# Altium project BKRES_IOT_BOARD.PrjPcb
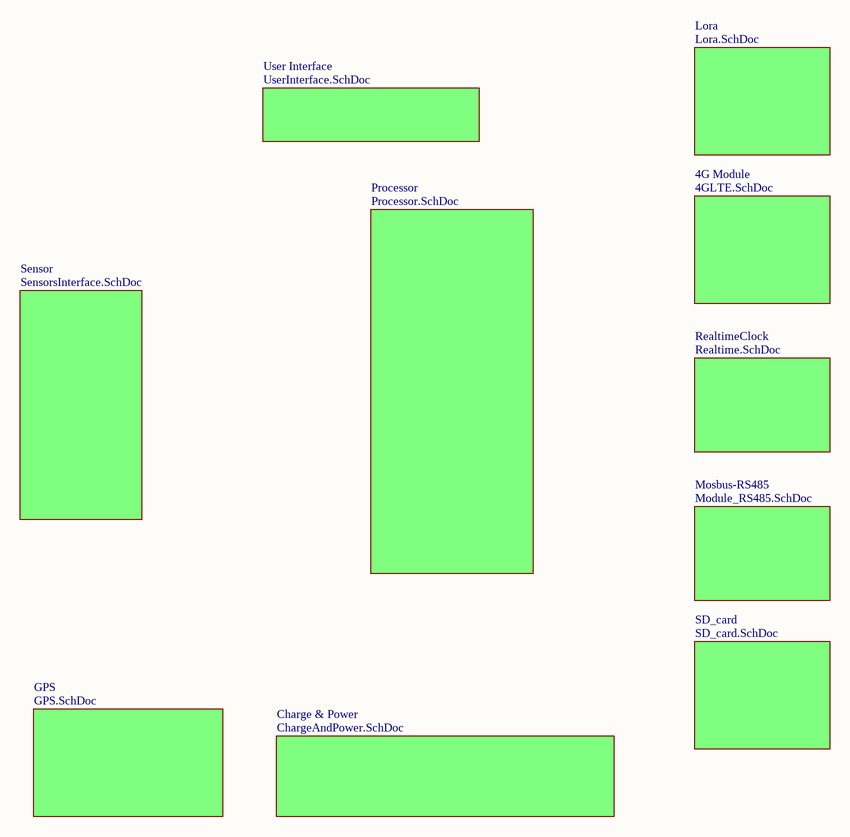
[diagram p0: BKRES_IOT_BOARD.SchDoc]
10 sheets, 25 parts. Net scope: global (net labels, ports and power ports of the same name join across sheets).
Board file: BKRES_IOT_BOARD.PcbDoc
Sheets:
  BKRES_IOT_BOARD.SchDoc
    Sensor = SensorsInterface.SchDoc
    Processor = Processor.SchDoc
    Lora = Lora.SchDoc
    4G Module = 4GLTE.SchDoc
    RealtimeClock = Realtime.SchDoc
    Charge & Power = ChargeAndPower.SchDoc
    Mosbus-RS485 = Module_RS485.SchDoc
    SD_card = SD_card.SchDoc
    GPS = GPS.SchDoc

## Sheet BKRES_IOT_BOARD.SchDoc
size A; SheetNumber: 1; SheetTotal: 11

### Sub-sheets
4G Module = 4GLTE.SchDoc: no entries
Charge & Power = ChargeAndPower.SchDoc: no entries
GPS = GPS.SchDoc: no entries
Lora = Lora.SchDoc: no entries
Mosbus-RS485 = Module_RS485.SchDoc: no entries
Processor = Processor.SchDoc: no entries
RealtimeClock = Realtime.SchDoc: no entries
SD_card = SD_card.SchDoc: no entries
Sensor = SensorsInterface.SchDoc: no entries
User Interface = UserInterface.SchDoc (file not in this document): no entries

## Sheet SensorsInterface.SchDoc
size A; SheetNumber: 2; SheetTotal: 10

## Sheet Processor.SchDoc
size A; SheetNumber: 3; SheetTotal: 11
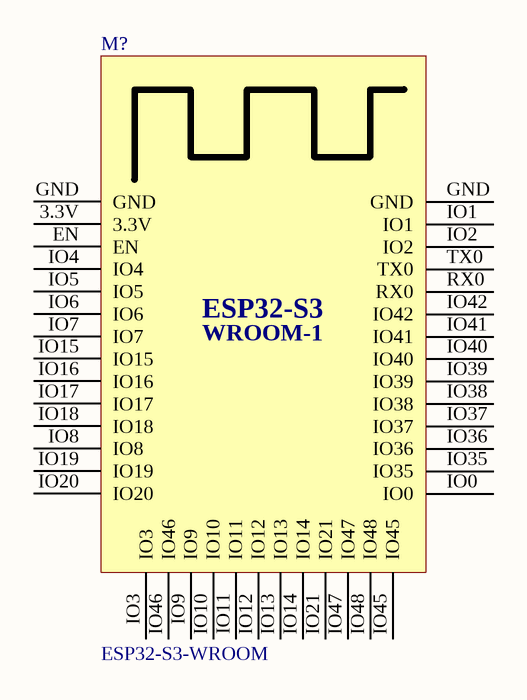
[diagram p1: Processor.SchDoc]

### Parts
M?  ESP32-S3-WROOM  [ESP32-S3-WROOM-1]

### Nets

Not connected (* = marked no-connect by the designer): M? 3.3V EN GND IO0 IO1 IO2 IO3 IO4 IO5 IO6 IO7 IO8 IO9 IO10 IO11 IO12 IO13 IO14 IO15 IO16 IO17 IO18 IO19 IO20 IO21 IO35 IO36 IO37 IO38 IO39 IO40 IO41 IO42 IO45 IO46 IO47 IO48 RX0 TX0

### Notes on the sheet
- (in symbol ESP32-S3-WROOM-1) ESP32-S3; WROOM-1

### Library data of the parts
M? = ESP32-S3-WROOM-1: Datasheet: https://www.espressif.com/sites/default/files/documentation/esp32-s3-wroom-1_wroom-1u_datasheet_en.pdf

## Sheet Lora.SchDoc
size A; SheetNumber: 4; SheetTotal: 11
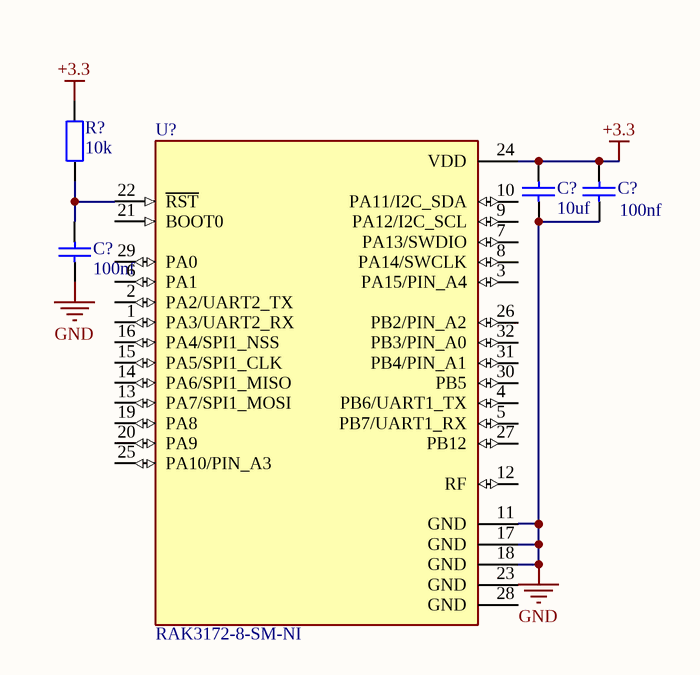
[diagram p2: Lora.SchDoc]

### Parts
(Parts that share a designator on the sheet are numbered #1, #2 ... from top to bottom, then left to right.)
C?#1  10uf  [tu 0805]
C?#2  100nf  [tu 0805]
C?#3  100nf  [tu 0805]
R?#1  10k  [tro smd 0805]
U?#1  RAK3172-8-SM-NI  [XCVR_RAK3172-8-SM-NI]

### Nets
+3.3: C?#1.1 C?#2.1 R?#1.2 U?#1.24(VDD)
GND: C?#1.2 C?#2.2 C?#3.2 U?#1.11(GND) U?#1.17(GND) U?#1.18(GND)
NetC?#3_1: C?#3.1 R?#1.1 U?#1.22(~{RST})

Not connected (* = marked no-connect by the designer): U?#1 1(PA3/UART2_RX) 2(PA2/UART2_TX) 3(PA15/PIN_A4) 4(PB6/UART1_TX) 5(PB7/UART1_RX) 6(PA1) 7(PA13/SWDIO) 8(PA14/SWCLK) 9(PA12/I2C_SCL) 10(PA11/I2C_SDA) 12(RF) 13(PA7/SPI1_MOSI) 14(PA6/SPI1_MISO) 15(PA5/SPI1_CLK) 16(PA4/SPI1_NSS) 19(PA8) 20(PA9) 21(BOOT0) 23(GND) 25(PA10/PIN_A3) 26(PB2/PIN_A2) 27(PB12) 28(GND) 29(PA0) 30(PB5) 31(PB4/PIN_A1) 32(PB3/PIN_A0)

### Library data of the parts
C?#1-C?#3 = Tu 0805 104 50V 10%: Dán; Don_Vi: Con; So_Chan: 2; Ten_Linh_Kien: Tụ 0805 104-100nF 10% 50V; Ma_Hang: MH004551; Chung_Loai: Dán; Kieu_Chan: *
R?#1 = Tro 0805 1% 10R: Dán; Don_Vi: Con; So_Chan: 2; Ten_Linh_Kien: Trở 0805 1% 10R; Ma_Hang: MH005474; Chung_Loai: Dán; Kieu_Chan: *
U?#1 = RAK3172-8-SM-NI: RF IC Transceiver LoRaWAN 864MHz, 865MHz, 868MHz 2V ~ 3.6V Supply, Without IPEX Connector; MF: RAKwireless Technology Limited; Package: None; Price: None; Check_prices: https://www.snapeda.com/parts/RAK3172-8-SM-NI/ESS+Technology/view-part/?ref=eda; Value: *; SnapEDA_Link: https://www.snapeda.com/parts/RAK3172-8-SM-NI/ESS+Technology/view-part/?ref=snap; MP: RAK3172-8-SM-NI; Availability: In Stock; Purchase-URL: https://pricing.snapeda.com/search?q=RAK3172-8-SM-NI&ref=eda

## Sheet 4GLTE.SchDoc
size A; SheetNumber: 5; SheetTotal: 11
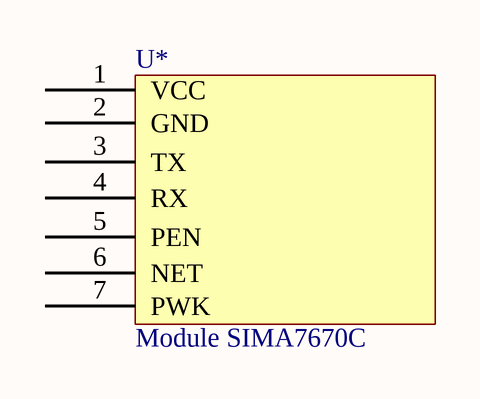
[diagram p3: 4GLTE.SchDoc]

### Parts
(Parts that share a designator on the sheet are numbered #1, #2 ... from top to bottom, then left to right.)
U*#1  Module SIMA7670C  [Module sim7670C]

### Nets

Not connected (* = marked no-connect by the designer): U*#1 1(VCC) 2(GND) 3(TX) 4(RX) 5(PEN) 6(NET) 7(PWK)

## Sheet Realtime.SchDoc
size A; SheetNumber: 6; SheetTotal: 11
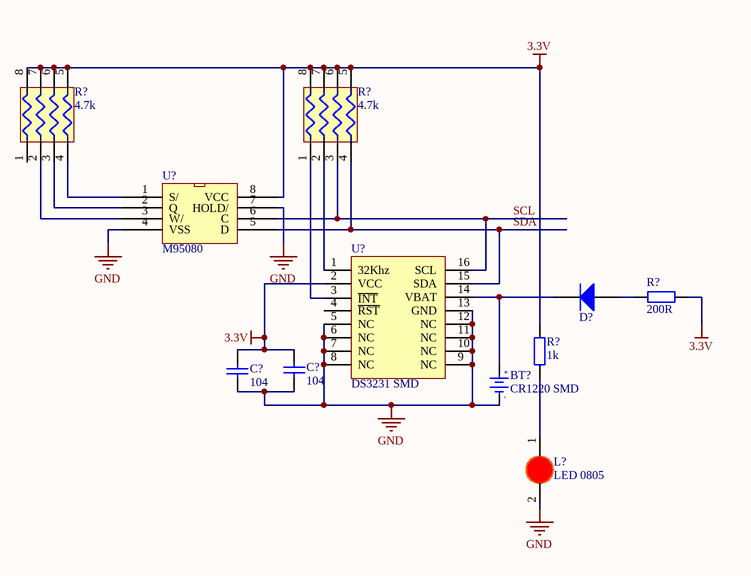
[diagram p4: Realtime.SchDoc]

### Parts
(Parts that share a designator on the sheet are numbered #1, #2 ... from top to bottom, then left to right.)
BT?  CR1220 SMD  [DE PIN CR1220]
C?#4  104  [tu 0805]
C?#5  104  [tu 0805]
D?  Diode  [SOD80]  (value not drawn)
L?  LED 0805  [LED-0805-Red]
R?#2  4.7k  [tro bang 0603 4]
R?#3  4.7k  [tro bang 0603 4]
R?#4  200R  [tro smd 0805]
R?#5  1k  [tro smd 0805]
U?#2  M95080  [SOP8_L]
U?#3  DS3231 SMD  [SOIC 16]

### Nets
3.3V: C?#4.1 C?#5.1 R?#2.5 R?#2.6 R?#2.7 R?#2.8 R?#3.5 R?#3.6 R?#3.7 R?#3.8 R?#4.2 R?#5.2 U?#2.8(VCC) U?#3.2(VCC)
GND: BT?.2(GND) C?#4.2 C?#5.2 L?.2(K) U?#2.4(VSS) U?#2.7(HOLD/) U?#3.5(NC) U?#3.6(NC) U?#3.7(NC) U?#3.8(NC) U?#3.9(NC) U?#3.10(NC) U?#3.11(NC) U?#3.12(NC) U?#3.13(GND)
SCL: R?#3.3 U?#2.6(C) U?#3.16(SCL)
SDA: R?#3.4 U?#2.5(D) U?#3.15(SDA)
NetBT?_1: BT?.1(+3V) D?.2(K) U?#3.14(VBAT)
NetD?_1: D?.1(A) R?#4.1
NetL?_1: L?.1(A) R?#5.1
NetR?#2_2: R?#2.2 U?#2.3(W/)
NetR?#2_3: R?#2.3 U?#2.2(Q)
NetR?#2_4: R?#2.4 U?#2.1(S/)
NetR?#3_1: R?#3.1 U?#3.3(~{INT})
NetR?#3_2: R?#3.2 U?#3.1(32Khz)

Not connected (* = marked no-connect by the designer): R?#2 1; U?#3 4(~{RST})

### Notes on the sheet
- (in symbol De pin CR1220 SMD) +; -

### Library data of the parts
BT? = De pin CR1220 SMD: Ten: Đế PIN CR1220 SMD; Ma_Hang: MH000833
C?#4 C?#5 = Tu 0805 104 50V 10%: as C?#1 on sheet Lora; Chung_Loai: Dán; Kieu_Chan: *
D? = Diode: Default Diode; Published: 8-Jun-2000; LatestRevisionDate: 17-Jul-2002; LatestRevisionNote: Re-released for DXP Platform.; PackageVersion: Sep-1996; PackageReference: SMC; Publisher: Altium Limited; Code_JEDEC: DO-214-AB
L? = LED 0805 Do: Dán; Don_Vi: Con; Ma_Hang: MH000897; Ten_Linh_Kien: LED 0805 Màu Đỏ (Red); Ghi_Chu: *; Kieu_Chan: *; Chung_Loai: Dán
R?#2 R?#3 = Tro bang 0603 4.7k: Dán; Don_Vi: Con; So_Chan: 8; Ten_Linh_Kien: Trở băng 0603x4 4.7k; Ma_Hang: MH001448; Chung_Loai: Dán; Kieu_Chan: *
R?#4 = Tro 0805 5% 220R: Dán; Don_Vi: Con; So_Chan: 2; Ten_Linh_Kien: Trở 0805 5% 220R; Ma_Hang: MH005259; Chung_Loai: Dán; Kieu_Chan: *
R?#5 = Tro 0805 1% 1k: Dán; Don_Vi: Con; So_Chan: 2; Ten_Linh_Kien: Trở 0805 1% 1k; Ma_Hang: MH005468; Chung_Loai: Dán; Kieu_Chan: *
U?#2 = EEPROM_M95080
U?#3 = DS3231 SMD: SOIC

## Sheet ChargeAndPower.SchDoc
size A; SheetNumber: 7; SheetTotal: 9

## Sheet Module_RS485.SchDoc
size A4; SheetNumber: 11; SheetTotal: 11
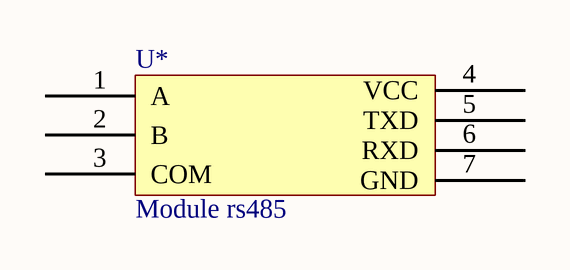
[diagram p5: Module_RS485.SchDoc]

### Parts
(Parts that share a designator on the sheet are numbered #1, #2 ... from top to bottom, then left to right.)
U*#2  Module rs485

### Nets

Not connected (* = marked no-connect by the designer): U*#2 1(A) 2(B) 3(COM) 4(VCC) 5(TXD) 6(RXD) 7(GND)

## Sheet SD_card.SchDoc
size A4; SheetNumber: 10; SheetTotal: 10
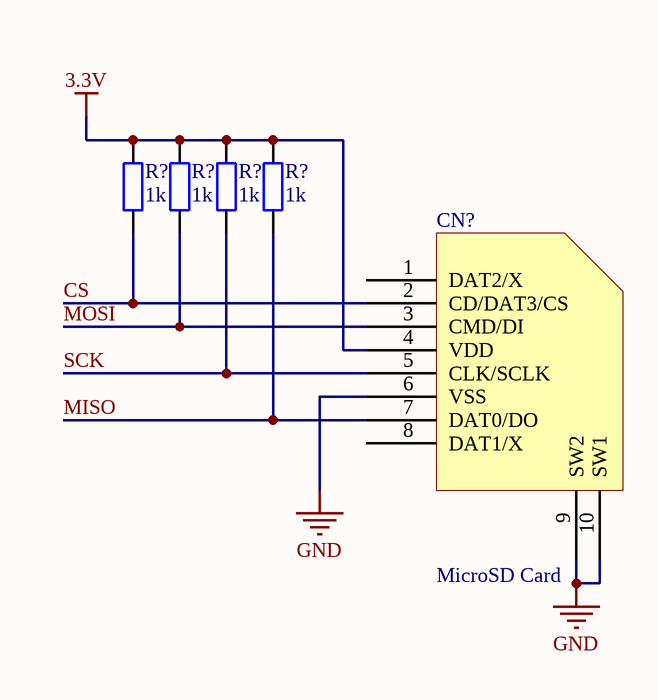
[diagram p6: SD_card.SchDoc]

### Parts
(Parts that share a designator on the sheet are numbered #1, #2 ... from top to bottom, then left to right.)
CN?  MicroSD Card  [MicroSD Card]
R?#6  1k  [tro smd 0805]
R?#7  1k  [tro smd 0805]
R?#8  1k  [tro smd 0805]
R?#9  1k  [tro smd 0805]

### Nets
3.3V: CN?.4(VDD) R?#6.1 R?#7.2 R?#8.2 R?#9.2
GND: CN?.6(VSS) CN?.9(SW2) CN?.10(SW1)
CS: CN?.2(CD/DAT3/CS) R?#6.2
MISO: CN?.7(DAT0/DO) R?#9.1
MOSI: CN?.3(CMD/DI) R?#7.1
SCK: CN?.5(CLK/SCLK) R?#8.1

Not connected (* = marked no-connect by the designer): CN? 1(DAT2/X) 8(DAT1/X)

### Library data of the parts
R?#6-R?#9 = Tro 0805 1% 1k: as R?#5 on sheet Realtime; Chung_Loai: Dán; Kieu_Chan: *

## Sheet GPS.SchDoc
size A4; SheetNumber: 9; SheetTotal: 11
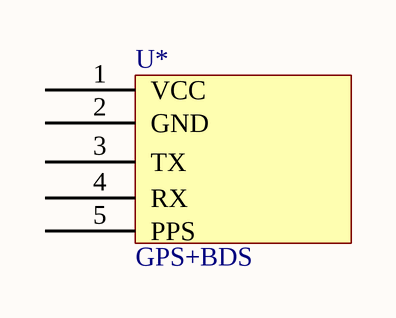
[diagram p7: GPS.SchDoc]

### Parts
(Parts that share a designator on the sheet are numbered #1, #2 ... from top to bottom, then left to right.)
U*#3  GPS+BDS

### Nets

Not connected (* = marked no-connect by the designer): U*#3 1(VCC) 2(GND) 3(TX) 4(RX) 5(PPS)

## Nets that join several sheets
3.3V: Realtime (14 pins), SD_card (5 pins)
GND: Lora (6 pins), Realtime (15 pins), SD_card (CN?.6 CN?.9 CN?.10)